# EAGLE design GaggiaBoard_V2 (EAGLE 9.6.2)

## Sheet 1 of 2
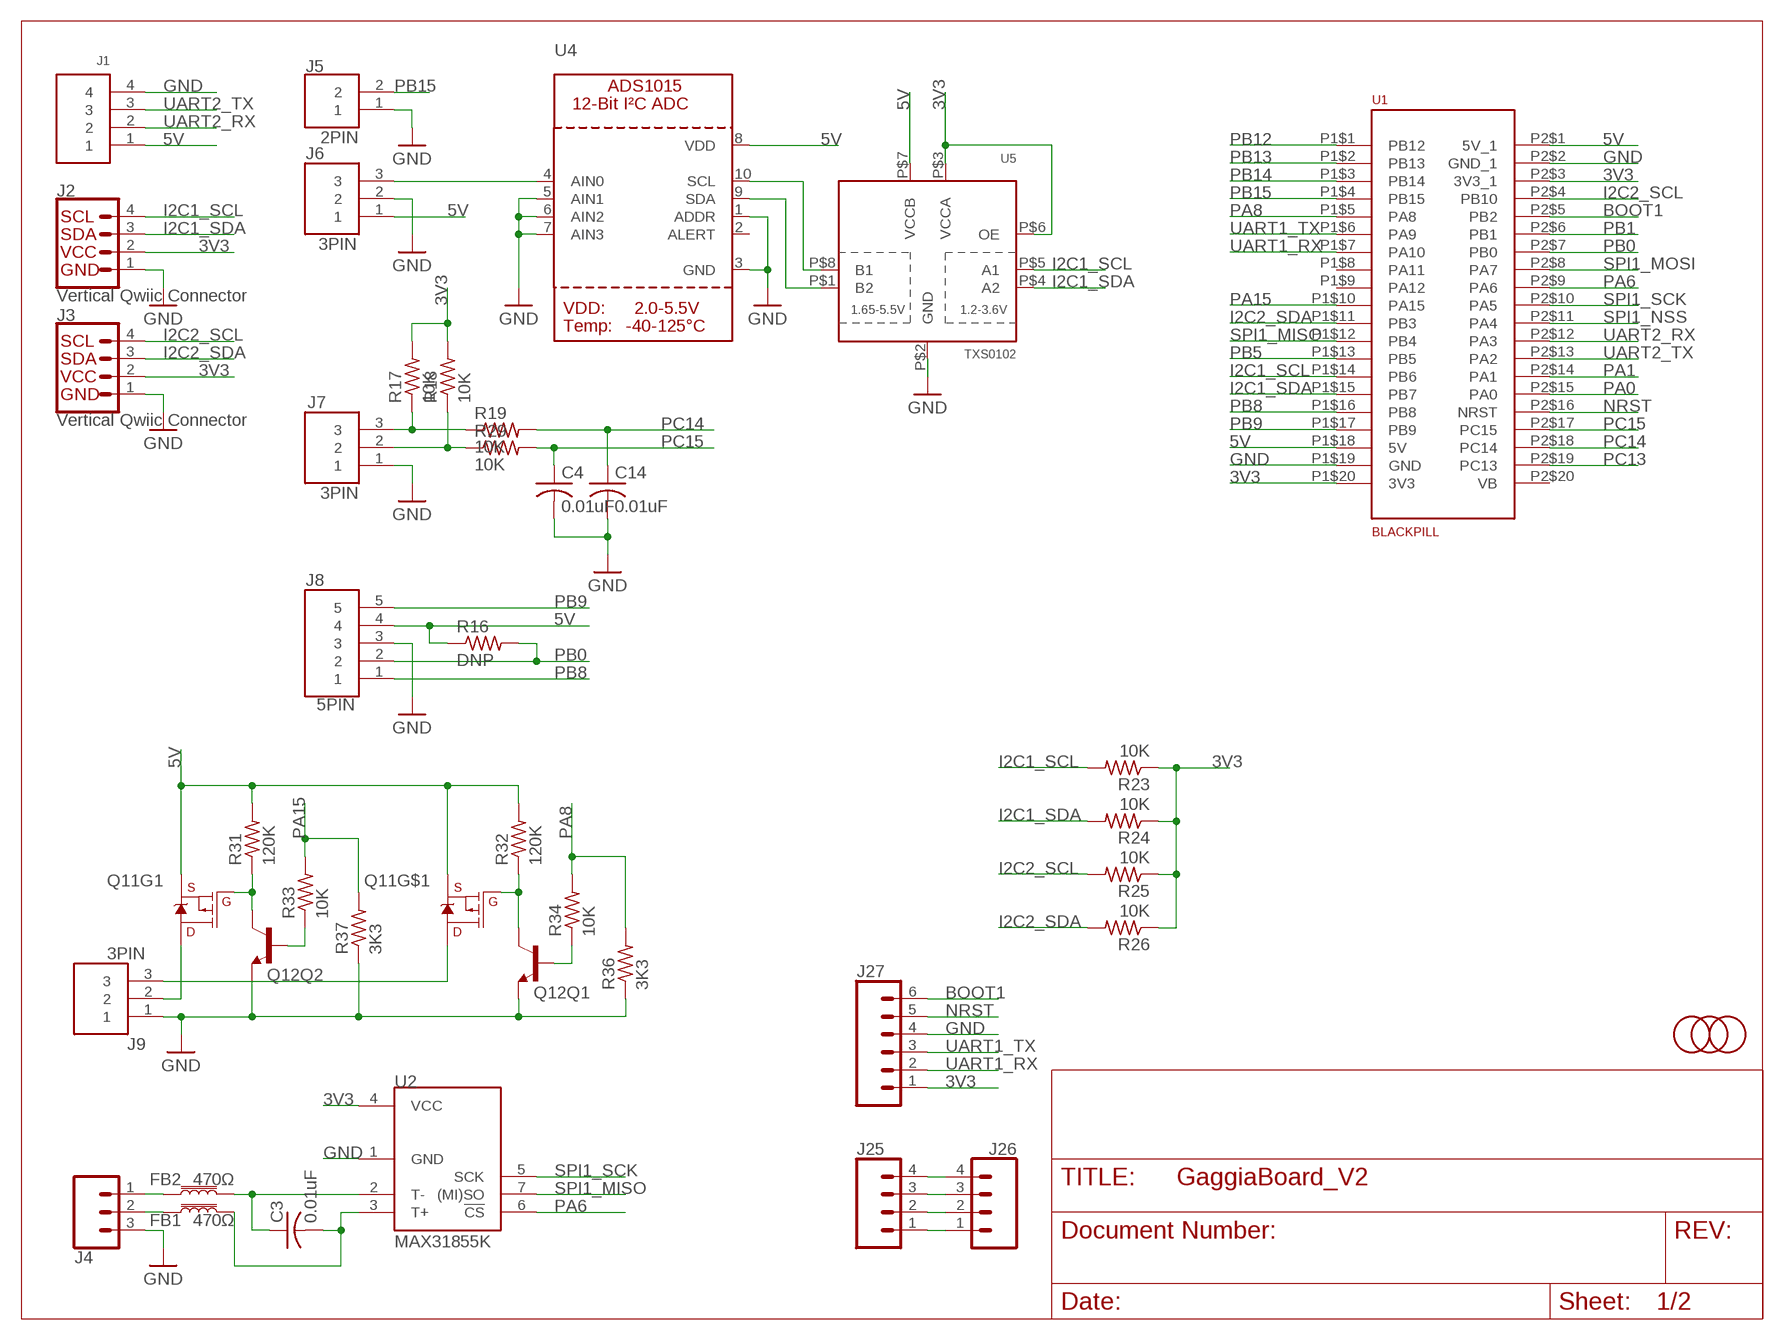
[diagram p0: schematic, sheet 1]

### Parts
C3  0.01uF  C-USC0603  [C0603]
C4  0.01uF  C-USC0603  [C0603]
C14  0.01uF  C-USC0603  [C0603]
FB1  470Ω  FERRITE_BEAD-0603-470Ω-100MHZ-1A-200MILIΩ  [0603]
FB2  470Ω  FERRITE_BEAD-0603-470Ω-100MHZ-1A-200MILIΩ  [0603]
J1  4PIN  [B4B-XH-K-S]
J2  Vertical Qwiic Connector  QWIIC_CONNECTOR  [JST04_1MM_VERT]
J3  Vertical Qwiic Connector  QWIIC_CONNECTOR  [JST04_1MM_VERT]
J4  CONN_03SCREW  [SCREWTERMINAL-3.5MM-3]
J5  2PIN  [B2B-PH-K-S]
J6  3PIN  [B3B-PH-K-S]
J7  3PIN  [B3B-PH-K-S]
J8  5PIN  [B5B-PH-K-S]
J9  3PIN  [B3B-PH-K-S]
J25  CONN_041X04_NO_SILK  [1X04_NO_SILK]
J26  CONN_041X04_NO_SILK  [1X04_NO_SILK]
J27  CONN_06NO_SILK_FEMALE_PTH  [1X06_NO_SILK]
MARK1  FIDUCIAL  [FIDUCIAL_1MM]
MARK2  FIDUCIAL  [FIDUCIAL_1MM]
MARK5  FIDUCIAL  [FIDUCIAL_1MM]
Q11  MOSFET_PCH_DUAL-DMP2240UDM  [SOT26]
Q12  TRANS_NPN_DUAL-MBT3904DW1T1  [SC70-6]
R16  DNP  R-US_R0603  [R0603]
R17  10K  R-US_R0603  [R0603]
R18  10K  R-US_R0603  [R0603]
R19  10K  R-US_R0603  [R0603]
R23  10K  R-US_R0603  [R0603]
R24  10K  R-US_R0603  [R0603]
R25  10K  R-US_R0603  [R0603]
R26  10K  R-US_R0603  [R0603]
R29  10K  R-US_R0603  [R0603]
R31  120K  R-US_R0603  [R0603]
R32  120K  R-US_R0603  [R0603]
R33  10K  R-US_R0603  [R0603]
R34  10K  R-US_R0603  [R0603]
R36  3K3  R-US_R0603  [R0603]
R37  3K3  R-US_R0603  [R0603]
U1  BLACKPILL  [BLACKPILL]
U2  MAX31855K  [SO08]
U4  ADC_ADS1015  [MSOP10]
U5  TXS0102  [VFSOP-8]

### Nets
3V3: J2.2 J3.2 J25.1 J26.1 J27.1 R17.2 R18.2 R23.1 R24.1 R25.1 R26.1 U1.P1$20(3V3) U1.P2$3(3V3_1) U2.4(VCC) U5.P$3(VCCA) U5.P$6(OE) ; also sheet 2
5V: J1.1 J6.1 J8.4 Q11.S1(S) Q11.S2(S) R16.1 R31.2 R32.2 U1.P1$18(5V) U1.P2$1(5V_1) U4.8(VDD) U5.P$7(VCCB) ; also sheet 2
BOOT1: J27.6 U1.P2$5(PB2)
GND: C4.2 C14.2 J1.4 J2.1 J3.1 J4.3 J5.1 J6.2 J7.1 J8.3 J9.1 J25.4 J26.4 J27.4 Q12.1(Q2:E) Q12.4(Q1:E) R36.1 R37.1 U1.P1$19(GND) U1.P2$2(GND_1) U2.1(GND) U4.1(ADDR) U4.3(GND) U4.5(AIN1) U4.6(AIN2) U4.7(AIN3) U5.P$2(GND) ; also sheet 2
I2C1_SCL: J2.4 R23.2 U1.P1$14(PB6) U5.P$5(A1)
I2C1_SDA: J2.3 R24.2 U1.P1$15(PB7) U5.P$4(A2)
I2C2_SCL: J3.4 R25.2 U1.P2$4(PB10)
I2C2_SDA: J3.3 R26.2 U1.P1$11(PB3)
N$3: FB2.1 J4.1
N$4: FB1.1 J4.2
N$5: C3.1 FB2.2 U2.2(T-)
N$6: J7.3 R17.1 R19.1
N$22: U4.10(SCL) U5.P$8(B1)
N$23: J7.2 R18.1 R29.1
N$26: C3.2 FB1.2 U2.3(T+)
N$38: U4.9(SDA) U5.P$1(B2)
N$41: J9.3 Q11.D2(D)
N$42: J9.2 Q11.D1(D)
N$46: Q12.2(Q2:B) R33.1
N$47: Q11.G2(G) Q12.3(Q1:C) R32.1
N$48: Q11.G1(G) Q12.6(Q2:C) R31.1
N$49: Q12.5(Q1:B) R34.1
NRST: J27.5 U1.P2$16(NRST)
PA0: U1.P2$15(PA0) ; also sheet 2
PA1: U1.P2$14(PA1) ; also sheet 2
PA6: U1.P2$9(PA6) U2.6(!CS)
PA8: R34.2 R36.2 U1.P1$5(PA8)
PA15: R33.2 R37.2 U1.P1$10(PA15)
PB0: J8.2 R16.2 U1.P2$7(PB0)
PB1: U1.P2$6(PB1)
PB5: U1.P1$13(PB5)
PB8: J8.1 U1.P1$16(PB8)
PB9: J8.5 U1.P1$17(PB9)
PB12: U1.P1$1(PB12) ; also sheet 2
PB13: U1.P1$2(PB13) ; also sheet 2
PB14: U1.P1$3(PB14) ; also sheet 2
PB15: J5.2 U1.P1$4(PB15)
PC13: U1.P2$19(PC13) ; also sheet 2
PC14: C14.1 R19.2 U1.P2$18(PC14)
PC15: C4.1 R29.2 U1.P2$17(PC15)
PRESSURE: J6.3 U4.4(AIN0)
SPI1_MISO: U1.P1$12(PB4) U2.7((MI)SO)
SPI1_MOSI: U1.P2$8(PA7)
SPI1_NSS: U1.P2$11(PA4)
SPI1_SCK: U1.P2$10(PA5) U2.5(SCK)
SWCLK: J25.3 J26.3
SWDIO: J25.2 J26.2
UART1_RX: J27.2 U1.P1$7(PA10)
UART1_TX: J27.3 U1.P1$6(PA9)
UART2_RX: J1.2 U1.P2$12(PA3)
UART2_TX: J1.3 U1.P2$13(PA2)
Unconnected: U1.P1$8(PA11) U1.P1$9(PA12) U1.P2$20(VB) U4.2(ALERT)

## Sheet 2 of 2
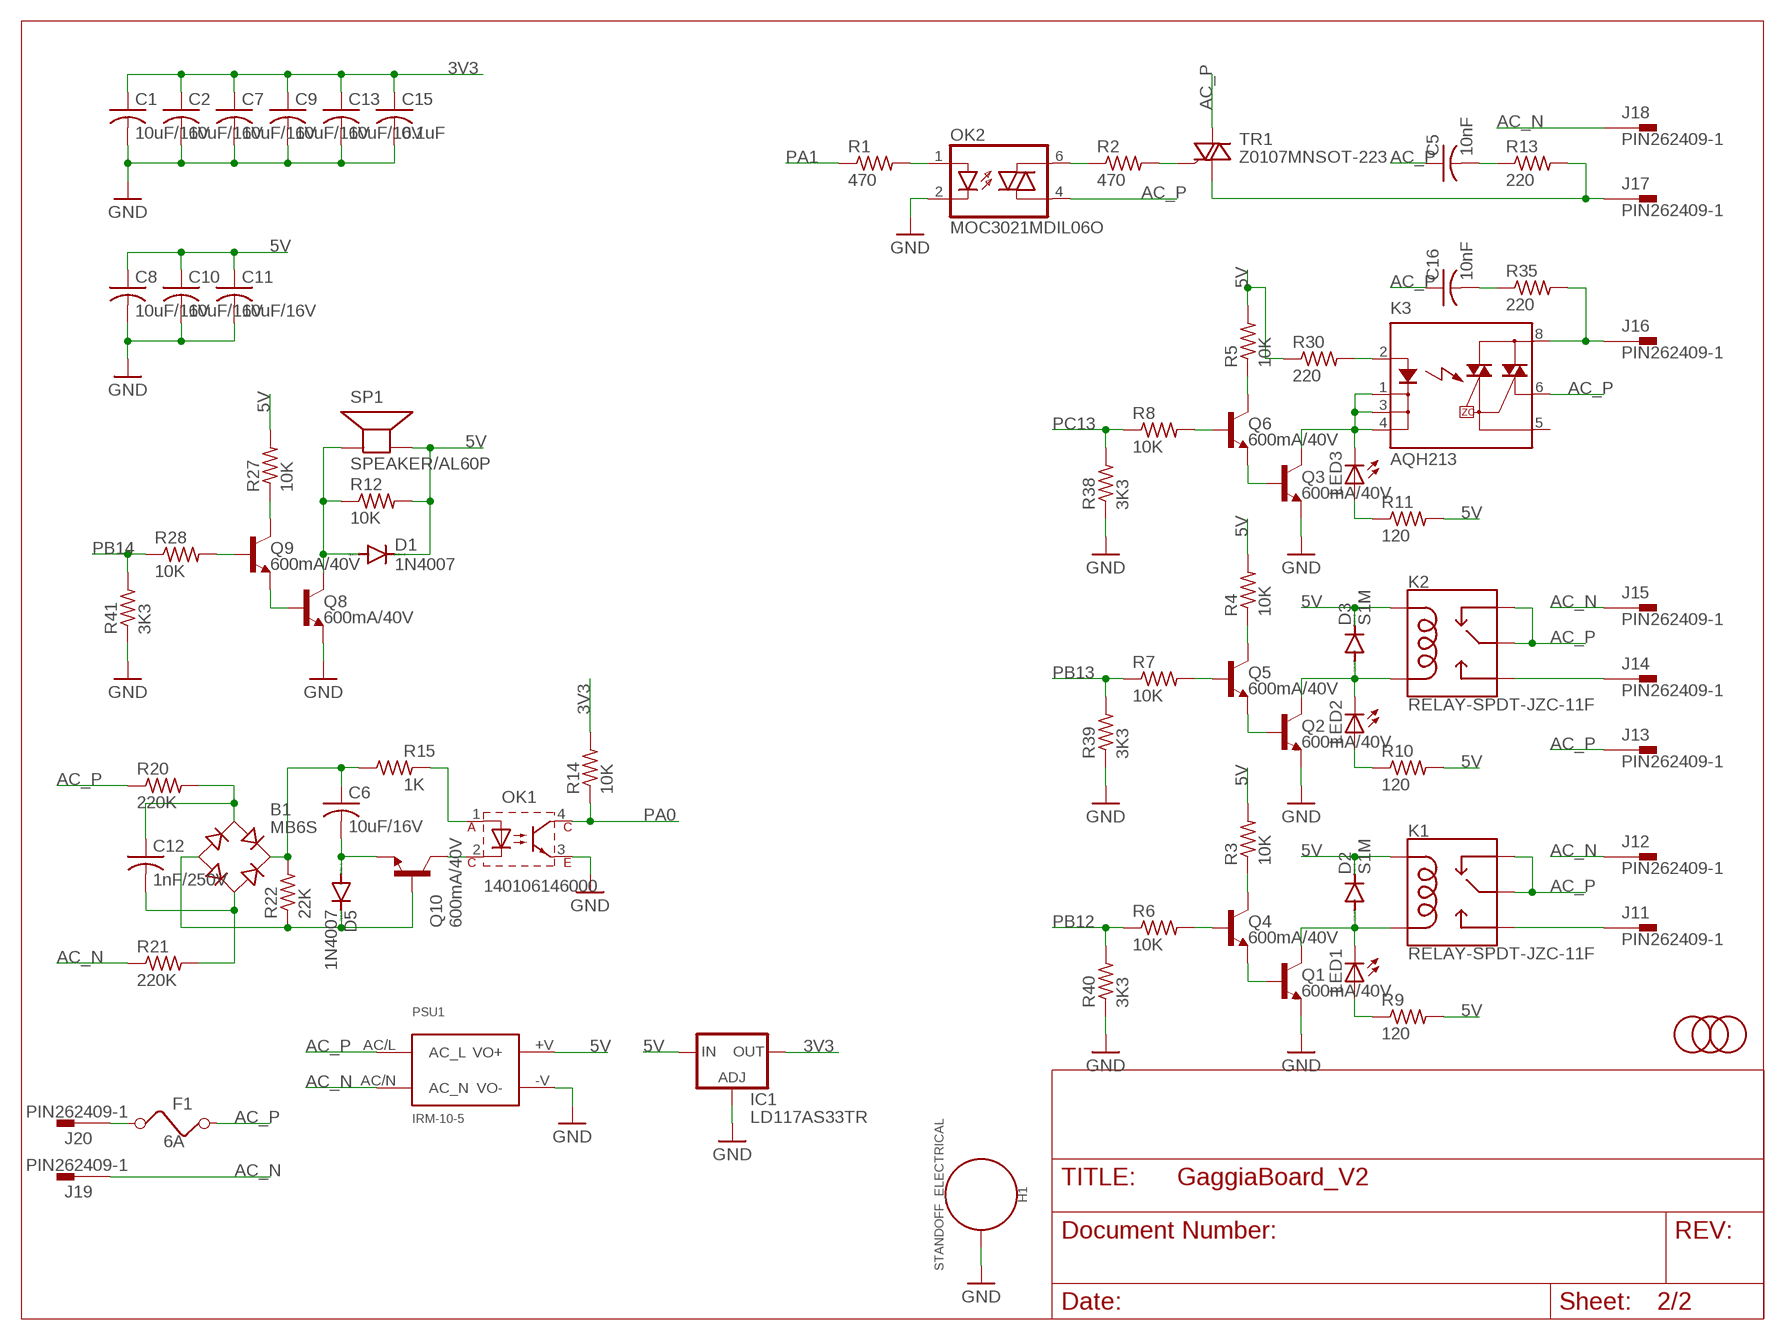
[diagram p1: schematic, sheet 2]

### Parts
B1  MB6S  [SOIC-4]
C1  10uF/16V  C-USC0603  [C0603]
C2  10uF/16V  C-USC0603  [C0603]
C5  10nF  C-USC1206  [C1206]
C6  10uF/16V  C-USC0603  [C0603]
C7  10uF/16V  C-USC0603  [C0603]
C8  10uF/16V  C-USC0603  [C0603]
C9  10uF/16V  C-USC0603  [C0603]
C10  10uF/16V  C-USC0603  [C0603]
C11  10uF/16V  C-USC0603  [C0603]
C12  1nF/250V  C-USC0603  [C0603]
C13  10uF/16V  C-USC0603  [C0603]
C15  0.1uF  C-USC0603  [C0603]
C16  10nF  C-USC1206  [C1206]
D1  1N4007  DIODE-DO214AC  [DO214AC]
D2  S1M  [SMA]
D3  S1M  [SMA]
D5  1N4007  DIODE-DO214AC  [DO214AC]
F1  6A  FUSE  [FUSE]
H1  STANDOFF_ELECTRICAL  [STANDOFF-ELECTRICAL]
IC1  LD117AS33TR  [SOT223]
J11  PIN262409-1  [62409-1]
J12  PIN262409-1  [62409-1]
J13  PIN262409-1  [62409-1]
J14  PIN262409-1  [62409-1]
J15  PIN262409-1  [62409-1]
J16  PIN262409-1  [62409-1]
J17  PIN262409-1  [62409-1]
J18  PIN262409-1  [62409-1]
J19  PIN262409-1  [62409-1]
J20  PIN262409-1  [62409-1]
K1  RELAY-SPDT-JZC-11F  [RELAY-JZC]
K2  RELAY-SPDT-JZC-11F  [RELAY-JZC]
K3  AQH213  [DIL07]
LED1  LEDCHIPLED_1206  [CHIPLED_1206]
LED2  LEDCHIPLED_1206  [CHIPLED_1206]
LED3  LEDCHIPLED_1206  [CHIPLED_1206]
MARK3  FIDUCIAL  [FIDUCIAL_1MM]
MARK4  FIDUCIAL  [FIDUCIAL_1MM]
MARK6  FIDUCIAL  [FIDUCIAL_1MM]
OK1  140106146000  WL-OCPT_SERIES_101X_140106146000  [WL-OCPT_LSOP4]
OK2  MOC3021MDIL06O  [DIL06O]
PSU1  IRM-10-5  [IRM-10]
Q1  600mA/40V  TRANS_NPN-MMBT2222AL  [SOT23-3]
Q2  600mA/40V  TRANS_NPN-MMBT2222AL  [SOT23-3]
Q3  600mA/40V  TRANS_NPN-MMBT2222AL  [SOT23-3]
Q4  600mA/40V  TRANS_NPN-MMBT2222AL  [SOT23-3]
Q5  600mA/40V  TRANS_NPN-MMBT2222AL  [SOT23-3]
Q6  600mA/40V  TRANS_NPN-MMBT2222AL  [SOT23-3]
Q8  600mA/40V  TRANS_NPN-MMBT2222AL  [SOT23-3]
Q9  600mA/40V  TRANS_NPN-MMBT2222AL  [SOT23-3]
Q10  600mA/40V  TRANS_NPN-MMBT2222AL  [SOT23-3]
R1  470  R-US_R0603  [R0603]
R2  470  R-US_R0603  [R0603]
R3  10K  R-US_R0603  [R0603]
R4  10K  R-US_R0603  [R0603]
R5  10K  R-US_R0603  [R0603]
R6  10K  R-US_R0603  [R0603]
R7  10K  R-US_R0603  [R0603]
R8  10K  R-US_R0603  [R0603]
R9  120  R-US_R0603  [R0603]
R10  120  R-US_R0603  [R0603]
R11  120  R-US_R0603  [R0603]
R12  10K  R-US_R0603  [R0603]
R13  220  R-US_R2512  [R2512]
R14  10K  R-US_R0603  [R0603]
R15  1K  R-US_R0603  [R0603]
R20  220K  R-US_R1206  [R1206]
R21  220K  R-US_R1206  [R1206]
R22  22K  R-US_R0603  [R0603]
R27  10K  R-US_R0603  [R0603]
R28  10K  R-US_R0603  [R0603]
R30  220  R-US_R0603  [R0603]
R35  220  R-US_R2512  [R2512]
R38  3K3  R-US_R0603  [R0603]
R39  3K3  R-US_R0603  [R0603]
R40  3K3  R-US_R0603  [R0603]
R41  3K3  R-US_R0603  [R0603]
SP1  SPEAKER/AL60P  [AL60P]
TR1  Z0107MNSOT-223  [SOT223]

### Nets
3V3: C1.1 C2.1 C7.1 C9.1 C13.1 C15.1 IC1.4(OUT) R14.2 ; also sheet 1
3WAY: J16.A1 J16.A2 K3.8(DS1) R35.2
5V: C8.1 C10.1 C11.1 D1.C D2.C D3.C IC1.3(IN) K1.5(COIL1) K2.5(COIL1) PSU1.+V(VO+) R3.2 R4.2 R5.2 R9.2 R10.2 R11.2 R12.2 R27.2 R30.1 SP1.2(-) ; also sheet 1
AC_N: J12.A1 J12.A2 J15.A1 J15.A2 J18.A1 J18.A2 J19.A1 J19.A2 PSU1.AC/N(AC_N) R21.1
AC_P: C5.1 C16.1 F1.2 J13.A1 J13.A2 K1.2(NC) K1.4(MAIN) K2.2(NC) K2.4(MAIN) K3.6(DS3) OK2.4(A1) PSU1.AC/L(AC_L) R20.1 TR1.2(A2) TR1.4(A2)
GND: C1.2 C2.2 C7.2 C8.2 C9.2 C10.2 C11.2 C13.2 C15.2 H1.P1 IC1.1(ADJ) OK1.3 OK2.2(C) PSU1.-V(VO-) Q1.2(E) Q2.2(E) Q3.2(E) Q8.2(E) R38.1 R39.1 R40.1 R41.1 ; also sheet 1
HEATER_1: J14.A1 J14.A2 K2.3(NO)
HEATER_2: J11.A1 J11.A2 K1.3(NO)
N$1: F1.1 J20.A1 J20.A2
N$2: B1.- D5.C Q10.1(B) R22.1
N$7: OK1.2 Q10.3(C)
N$8: OK2.6(A2) R2.1
N$9: R2.2 TR1.3(G)
N$10: D2.A K1.1(COIL2) LED1.C Q1.3(C)
N$11: D3.A K2.1(COIL2) LED2.C Q2.3(C)
N$12: K3.1(K) K3.3(K1) K3.4(K2) LED3.C Q3.3(C)
N$13: Q1.1(B) Q4.2(E)
N$14: Q2.1(B) Q5.2(E)
N$15: Q3.1(B) Q6.2(E)
N$16: Q6.1(B) R8.2
N$17: Q6.3(C) R5.1
N$18: Q5.3(C) R4.1
N$19: Q5.1(B) R7.2
N$20: Q4.3(C) R3.1
N$21: Q4.1(B) R6.2
N$24: LED1.A R9.1
N$25: K3.2(A) R30.2
N$27: C5.2 R13.1
N$28: LED2.A R10.1
N$29: LED3.A R11.1
N$30: D1.A Q8.3(C) R12.1 SP1.1(+)
N$31: C16.2 R35.1
N$33: Q8.1(B) Q9.2(E)
N$34: Q9.1(B) R28.2
N$35: Q9.3(C) R27.1
N$36: B1.~1(AC1) C12.2 R21.2
N$37: B1.~2(AC2) C12.1 R20.2
N$39: OK2.1(A) R1.2
N$43: C6.2 D5.A Q10.2(E)
N$44: OK1.1 R15.2
N$45: B1.+ C6.1 R15.1 R22.2
PA0: OK1.4 R14.1 ; also sheet 1
PA1: R1.1 ; also sheet 1
PB12: R6.1 R40.2 ; also sheet 1
PB13: R7.1 R39.2 ; also sheet 1
PB14: R28.1 R41.2 ; also sheet 1
PC13: R8.1 R38.2 ; also sheet 1
PUMP_P: J17.A1 J17.A2 R13.2 TR1.1(A1)
Unconnected: K3.5(DS2)

## Library data of the parts
B1 = rectifier:MB*S: Bridge Rectifier Source: http://www.fairchildsemi.com/ds/MB/MB6S.pdf; LCSC: C2487
C1 C2 C6-C11 C13 = rcl:C-US: CAPACITOR, American symbol; LCSC: C86275; SPICEPREFIX: C
C3 C4 C14 = rcl:C-US: CAPACITOR, American symbol; LCSC: C100042; SPICEPREFIX: C
C5 C16 = rcl:C-US: CAPACITOR, American symbol; LCSC: C107192; SPICEPREFIX: C
C12 = rcl:C-US: CAPACITOR, American symbol; LCSC: C277510; SPICEPREFIX: C
C15 = rcl:C-US: CAPACITOR, American symbol; LCSC: C1591; SPICEPREFIX: C
D1 D5 = diode:DIODE-: DIODE; LCSC: C727081
D2 D3 = diode:S1M; LCSC: C155378
F1 = special:FUSE: FUSE 5 x 20 mm; LCSC: C206887
FB1 FB2 = SparkFun-Coils:FERRITE_BEAD: Ferrite Bead (blocks, cores, rings, chokes, etc.) Inductor with layers of ferrite used to suppress high frequencies. Often used to isolate high frequency noise. SparkFun Products: IOIO-OTG - V2.2 <https://www.sparkfun.com/products/13613> SparkFun SAMD21 Mini Breakout <https://www.sparkfun.com/products/13664> SparkFun 6 Degrees of Freedom Breakout - LSM6DS3 <https://www.sparkfun.com/products/13339> SparkFun SAMD21 Dev Breakout <https://www.sparkfun.com/products/13672>; LCSC: C883591; PROD_ID: NDUC-12579
H1 = SparkFun-Hardware:STANDOFF_ELECTRICAL: Stand Off Drill holes with an electrical connection. For example, use these to ground your board to a chassis. Example SparkFun Products Screw - Phillips Head (1/4", 4-40, 10 pack) <https://www.sparkfun.com/products/10453> (PRT-10453) Screw - Phillips Head (1/2", 4-40, 10 pack) <https://www.sparkfun.com/products/10452> (PRT-10452) Screw - Phillips Head (3/4", 4-40, 10 pack) <https://www.sparkfun.com/products/10451> (PRT-10451) Screw - Phillips Head (1", 4-40, 10 pack) <https://www.sparkfun.com/products/10450> (PRT-10450)
IC1 = v-reg:LD117A?*: Low drop fixed and adjustable positive voltage regulators 1 A Source: http://www.st.com/stonline/products/literature/ds/7194/ld1117axx.pdf; LCSC: C26537
J1 = jst_exh:4PIN; LCSC: C144395
J2 J3 = SparkFun-Connectors:QWIIC_CONNECTOR: SparkFun I2C Standard Qwiic Connector An SMD 1mm pitch JST connector makes it easy and quick (get it? Qwiic?) to connect I2C devices to each other. The Qwiic system <http://www.sparkfun.com/qwiic> enables fast and solderless connection between popular platforms and various sensors and actuators. We carry 200mm <https://www.sparkfun.com/products/14204>, 100mm <https://www.sparkfun.com/products/14205>, 50mm <https://www.sparkfun.com/products/14206>, and breadboard friendly <https://www.sparkfun.com/products/14207> Qwiic cables. We also offer 10 pcs strips <https://www.sparkfun.com/products/14323> the SMD connectors.; LCSC: C160390; PROD_ID: CONN-14483
J4 = SparkFun-Connectors:CONN_03: Multi connection point. Often used as Generic Header-pin footprint for 0.1 inch spaced/style header connections On any of the 0.1 inch spaced packages, you can populate with these: Break Away Headers - Straight <https://www.sparkfun.com/products/116> (PRT-00116) Break Away Male Headers - Right Angle <https://www.sparkfun.com/products/553> (PRT-00553) Female Headers <https://www.sparkfun.com/products/115> (PRT-00115) Break Away Headers - Machine Pin <https://www.sparkfun.com/products/117> (PRT-00117) Break Away Female Headers - Swiss Machine Pin <https://www.sparkfun.com/products/743> (PRT-00743) Stackable Header - 3 Pin (Female, 0.1") <https://www.sparkfun.com/products/13875> (PRT-13875) For SCREWTERMINALS and SPRING TERMINALS visit here: Screw Terimnals on SparkFun.com <https://www.sparkfun.com/search/results?term=Screw+Terminals> (5mm/3.5mm/2.54mm spacing) This device is also useful as a general connection point to wire up your design to another part of your project. Our various solder wires solder well into these plated through hole pads. Hook-Up Wire - Assortment (Stranded, 22 AWG) <https://www.sparkfun.com/products/11375> (PRT-11375) Hook-Up Wire - Assortment (Solid Core, 22 AWG) <https://www.sparkfun.com/products/11367> (PRT-11367) View the entire wire category on our website here <https://www.sparkfun.com/categories/141> Special notes: Molex polarized connector foot print use with SKU : PRT-08232 with associated crimp pins and housings.; LCSC: C474893; PROD_ID: CONN-08288; SF_ID: PRT-08235
J5 = jst_eph:2PIN; LCSC: C131337
J6 J7 J9 = jst_eph:3PIN; LCSC: C131339
J8 = jst_eph:5PIN; LCSC: C157993
J11-J20 = con-faston:PIN2: Flachstecker Typ Tyco/Electronics/AMP TAB, FASTON Printed Circuit Board Tabs Source: http://www.buerklin.com, http://catalog.tycoelectronics.com; LCSC: C86495; OC_FARNELL: unknown; OC_NEWARK: unknown
J25 J26 = SparkFun-Connectors:CONN_04: Multi connection point. Often used as Generic Header-pin footprint for 0.1 inch spaced/style header connections On any of the 0.1 inch spaced packages, you can populate with these: Break Away Headers - Straight <https://www.sparkfun.com/products/116> (PRT-00116) Break Away Male Headers - Right Angle <https://www.sparkfun.com/products/553> (PRT-00553) Female Headers <https://www.sparkfun.com/products/115> (PRT-00115) Break Away Headers - Machine Pin <https://www.sparkfun.com/products/117> (PRT-00117) Break Away Female Headers - Swiss Machine Pin <https://www.sparkfun.com/products/743> (PRT-00743) For SCREWTERMINALS and SPRING TERMINALS visit here: Screw Terimnals on SparkFun.com <https://www.sparkfun.com/search/results?term=Screw+Terminals> (5mm/3.5mm/2.54mm spacing) This device is also useful as a general connection point to wire up your design to another part of your project. Our various solder wires solder well into these plated through hole pads. Hook-Up Wire - Assortment (Stranded, 22 AWG) <https://www.sparkfun.com/products/11375> (PRT-11375) Hook-Up Wire - Assortment (Solid Core, 22 AWG) <https://www.sparkfun.com/products/11367> (PRT-11367) View the entire wire category on our website here <https://www.sparkfun.com/categories/141> Special notes: Molex polarized connector foot print use with SKU : PRT-08231 with associated crimp pins and housings. 1MM SMD Version SKU: PRT-10208; PROD_ID: CONN-09696
J27 = SparkFun-Connectors:CONN_06: Multi connection point. Often used as Generic Header-pin footprint for 0.1 inch spaced/style header connections On any of the 0.1 inch spaced packages, you can populate with these: Break Away Headers - Straight <https://www.sparkfun.com/products/116> (PRT-00116) Break Away Male Headers - Right Angle <https://www.sparkfun.com/products/553> (PRT-00553) Female Headers <https://www.sparkfun.com/products/115> (PRT-00115) Break Away Headers - Machine Pin <https://www.sparkfun.com/products/117> (PRT-00117) Break Away Female Headers - Swiss Machine Pin <https://www.sparkfun.com/products/743> (PRT-00743) Arduino Stackable Header - 6 Pin <https://www.sparkfun.com/products/9280> (PRT-09280) For SCREWTERMINALS and SPRING TERMINALS visit here: Screw Terimnals on SparkFun.com <https://www.sparkfun.com/search/results?term=Screw+Terminals> (5mm/3.5mm/2.54mm spacing) This device is also useful as a general connection point to wire up your design to another part of your project. Our various solder wires solder well into these plated through hole pads. Hook-Up Wire - Assortment (Stranded, 22 AWG) <https://www.sparkfun.com/products/11375> (PRT-11375) Hook-Up Wire - Assortment (Solid Core, 22 AWG) <https://www.sparkfun.com/products/11367> (PRT-11367) View the entire wire category on our website here <https://www.sparkfun.com/categories/141>; PROD_ID: CONN-08437
K1 K2 = SparkFun-Electromechanical:RELAY-SPDT: SPDT Electromechanical Relay Single-pole, double-throw sealed relays. When current is applied to the coil, it throws a simple changeover switch, terminating the connection from the NC contact to ground and closing the NO contact. Use them to switch high voltage/high current devices. SparkFun Products JQX-15F: Relay SPDT Sealed - 20A <https://www.sparkfun.com/products/10924> (COM-10924) JZC-11F: Relay SPDT Sealed <https://www.sparkfun.com/products/100> (COM-00100); LCSC: C74541; PROD_ID: COMP-09533; SF_SKU: COM-00100
K3 = relay:AQH*213: SOLID STATE RELAY NAiS Source: http://www.mew-europe.com/.. en_ds_61613_0000.pdf; LCSC: C719560; OC_FARNELL: unknown; OC_NEWARK: unknown
LED1-LED3 = adafruit:LED: LED OSRAM: - CHIPLED LG R971, LG N971, LY N971, LG Q971, LY Q971, LO R971, LY R971 LH N974, LH R974 LS Q976, LO Q976, LY Q976 LO Q996 - Hyper CHIPLED LW Q18S LB Q993, LB Q99A, LB R99A - SideLED LS A670, LO A670, LY A670, LG A670, LP A670 LB A673, LV A673, LT A673, LW A673 LH A674 LY A675 LS A676, LA A676, LO A676, LY A676, LW A676 LS A679, LY A679, LG A679 - Hyper Micro SIDELED® LS Y876, LA Y876, LO Y876, LY Y876 LT Y87S - SmartLED LW L88C, LW L88S LB L89C, LB L89S, LG L890 LS L89K, LO L89K, LY L89K LS L896, LA L896, LO L896, LY L896 - TOPLED LS T670, LO T670, LY T670, LG T670, LP T670 LSG T670, LSP T670, LSY T670, LOP T670, LYG T670 LG T671, LOG T671, LSG T671 LB T673, LV T673, LT T673, LW T673 LH T674 LS T676, LA T676, LO T676, LY T676, LB T676, LH T676, LSB T676, LW T676 LB T67C, LV T67C, LT T67C, LS T67K, LO T67K, LY T67K, LW E67C LS E67B, LA E67B, LO E67B, LY E67B, LB E67C, LV E67C, LT E67C LW T67C LS T679, LY T679, LG T679 LS T770, LO T770, LY T770, LG T770, LP T770 LB T773, LV T773, LT T773, LW T773 LH T774 LS E675, LA E675, LY E675, LS T675 LS T776, LA T776, LO T776, LY T776, LB T776 LHGB T686 LT T68C, LB T68C - Hyper Mini TOPLED® LB M676 - Mini TOPLED Santana® LG M470 LS M47K, LO M47K, LY M47K Source: http://www.osram.convergy.de/; LCSC: C125086
MARK1-MARK6 = adafruit:FIDUCIAL: For use by pick and place machines to calibrate the vision/machine, 1mm By microbuilder.eu
OK1 = Wurth_Optocoupler_WL-OCPT:WL-OCPT_SERIES_101X: WL-OCPT LSOP-4 Series 101x Characteristics High isolation voltage Good stability of inner isolation Stable CTR in full operation temperature range Different CTR binnings available High Collector-Emitter voltage Fast switching times Applications Power Supply, charger Computers & Microprocessors Office equipment Instrumental applications, machines Ammeter, Smart Meter <https://www.we-online.de/katalog/media/o198230v209%20WL-OCPT_LSOP4_101x_multi-parts.jpg> Details see: www.we-online.com/catalog/WL-OCPT_PACKAGE_LSOP-4 <www.we-online.com/catalog/WL-OCPT_PACKAGE_LSOP-4/?utm_source=eagle_model&utm_medium=description_link&utm_campaign=eisos_eagle> Updated by Ella Wu, 2022-06-21 2022 (C) Wurth Elektronik; CTR-MAX: 300%; CTR-MIN: 100%; DATASHEET-URL: https://www.we-online.com/redexpert/spec/140106146000?ae; IF: 60mA; LCSC: C141610; MOUNT: SMT; PART-NUMBER: 140106146000; TC-CTR: IF = 5mA,VCE = 5 V; VCE: 80V; VISO: 5000(V(RMS))
OK2 = discrete:MOC3021M: RANDOM-PHASE OPTOISOLATORS TRIAC DRIVER OUTPUT; LCSC: C5242
PSU1 = discrete:IRM-10-5: MEAN WELL IRM-10-5 5V 10W Output Switching Power Supply; LCSC: C2857903; SPICEPREFIX: E
Q1-Q6 Q8-Q10 = SparkFun-DiscreteSemi:TRANS_NPN: NPN transistor Current controlled devices typically used to amplify current or used as a switch. BC547 - COM-08928 <http://www.sparkfun.com/products/8928> (TO-92 45V 100mA) (1.Collector 2.Base 3.Emitter) 2N3904 - COM-00521 <http://www.sparkfun.com/products/521> (TO-92 40V 200mA) (1.Emitter 2.Base 3.Collector) P2N2222A - COM-12852 <http://www.sparkfun.com/products/12852> (TO-92 40V 600mA) (1.Collector 2.Base 3.Emitter); LCSC: C82460; PROD_ID: TRANS-08049
Q11 = SparkFun-DiscreteSemi:MOSFET_PCH_DUAL: Dual P-Channel -20VDS MOSFET Link to datasheet <http://www.diodes.com/_files/datasheets/ds31197.pdf> SparkFun Products: SparkFun FreeSoC2 Development Board <https://www.sparkfun.com/products/13229>; LCSC: C397948; PROD_ID: TRANS-12444; VALUE: 2A/20V/150mΩ
Q12 = SparkFun-DiscreteSemi:TRANS_NPN_DUAL: Dual NPN Transistors in Single Package The MBT3904W1 puts two general purpose 3904 NPN transistors in a single package. Datasheet <http://www.onsemi.com/pub_link/Collateral/MBT3904DW1T1-D.PDF> SparkFun Products: SparkFun ESP32 Thing <https://www.sparkfun.com/products/13907>; LCSC: C896759; PROD_ID: TRANS-13337
R1 R2 = rcl:R-US_: RESISTOR, American symbol; LCSC: C114669; SPICEPREFIX: R
R3-R8 R12 R14 R17-R19 R23-R29 R33 R34 = rcl:R-US_: RESISTOR, American symbol; LCSC: C98220; SPICEPREFIX: R
R9-R11 = rcl:R-US_: RESISTOR, American symbol; LCSC: C114640; SPICEPREFIX: R
R13 R35 = rcl:R-US_: RESISTOR, American symbol; LCSC: C877859; SPICEPREFIX: R
R15 = rcl:R-US_: RESISTOR, American symbol; LCSC: C22548; SPICEPREFIX: R
R16 = rcl:R-US_: RESISTOR, American symbol; SPICEPREFIX: R
R20 R21 = rcl:R-US_: RESISTOR, American symbol; LCSC: C130275; SPICEPREFIX: R
R22 = rcl:R-US_: RESISTOR, American symbol; LCSC: C114065; SPICEPREFIX: R
R30 = rcl:R-US_: RESISTOR, American symbol; LCSC: C107696; SPICEPREFIX: R
R31 R32 = rcl:R-US_: RESISTOR, American symbol; LCSC: C114607; SPICEPREFIX: R
R36-R41 = rcl:R-US_: RESISTOR, American symbol; LCSC: C114432; SPICEPREFIX: R
SP1 = adafruit:SPEAKER: SPEAKER Source: Buerklin Added PS12 (for part # PS1240 piezo) http://www.ladyada.net/library/pcb/eaglelibrary.html; LCSC: C96093
TR1 = discrete:Z0107MN: Triacs 1.0 Amp 600 Volt; LCSC: C71218
U1 = discrete:BLACKPILL: STM32 BlackPill
U2 = SparkFun-IC-Conversion:MAX31855K: Cold-Junction-Compensated K-Thermocoupleto-Digital Converter (-270°C to +1800°C) The MAX31855K performs cold-junction compensation and digitizes the signal from a type-K thermocouple. The data is output in a 14-bit resolution, SPI™-compatible, read-only format. This converter resolves temperatures to 0.25°C, allows readings as high as +1800°C and as low as -270°C, and exhibits thermocouple accuracy of ±2°C for temperatures ranging from -200°C to +700°C for K-type thermocouples. Datasheet <https://cdn.sparkfun.com/datasheets/Sensors/Temp/MAX31855K.pdf> SparkFun Products SparkFun Thermocouple Breakout - MAX31855K <https://www.sparkfun.com/products/13266> (SEN-13266); LCSC: C52028; PROD_ID: IC-12578
U4 = microbuilder:ADC_ADS1015: ADS1015 - 12-bit 4-Channel I2C ADC with Internal PGA VDD: 2.0-5.5V Sampling Rate: 3.3ksps Gain Settings: 2/3, 1, 2, 4, 8, 16 I2C Address: ADDR low = 1001000x, ADDR high = 1001001x Internal Comparator The ADS1015 includes an internal comparator that can be set to output a high-level on ALERT when the conversion results exceeeds a pre-defined upper level, and will deassert itself when the level falls below a pre-defined lower threshold level. It can also be set to windowed mode where the ALERT pin will be asserted if the data exceeds the upper threshold or falls below the lower threshold.; LCSC: C193969
U5 = adafruit:TXS0102: 2-Bit Bi-Directional Level Shifter (I2C, etc.) Designed for I2C devices and has internal pullups. Not to be confused with TXB010x series. 1.2V-3.6V (VCCA) to 1.65V-5.5V (VCCB) bi-directional level shifter with auto direction sensing. Max data rate - 24Mbps (Push Pull), 2Mbps (Open Drain) Digikey: 296-21931-1-ND; LCSC: C53434

## Board
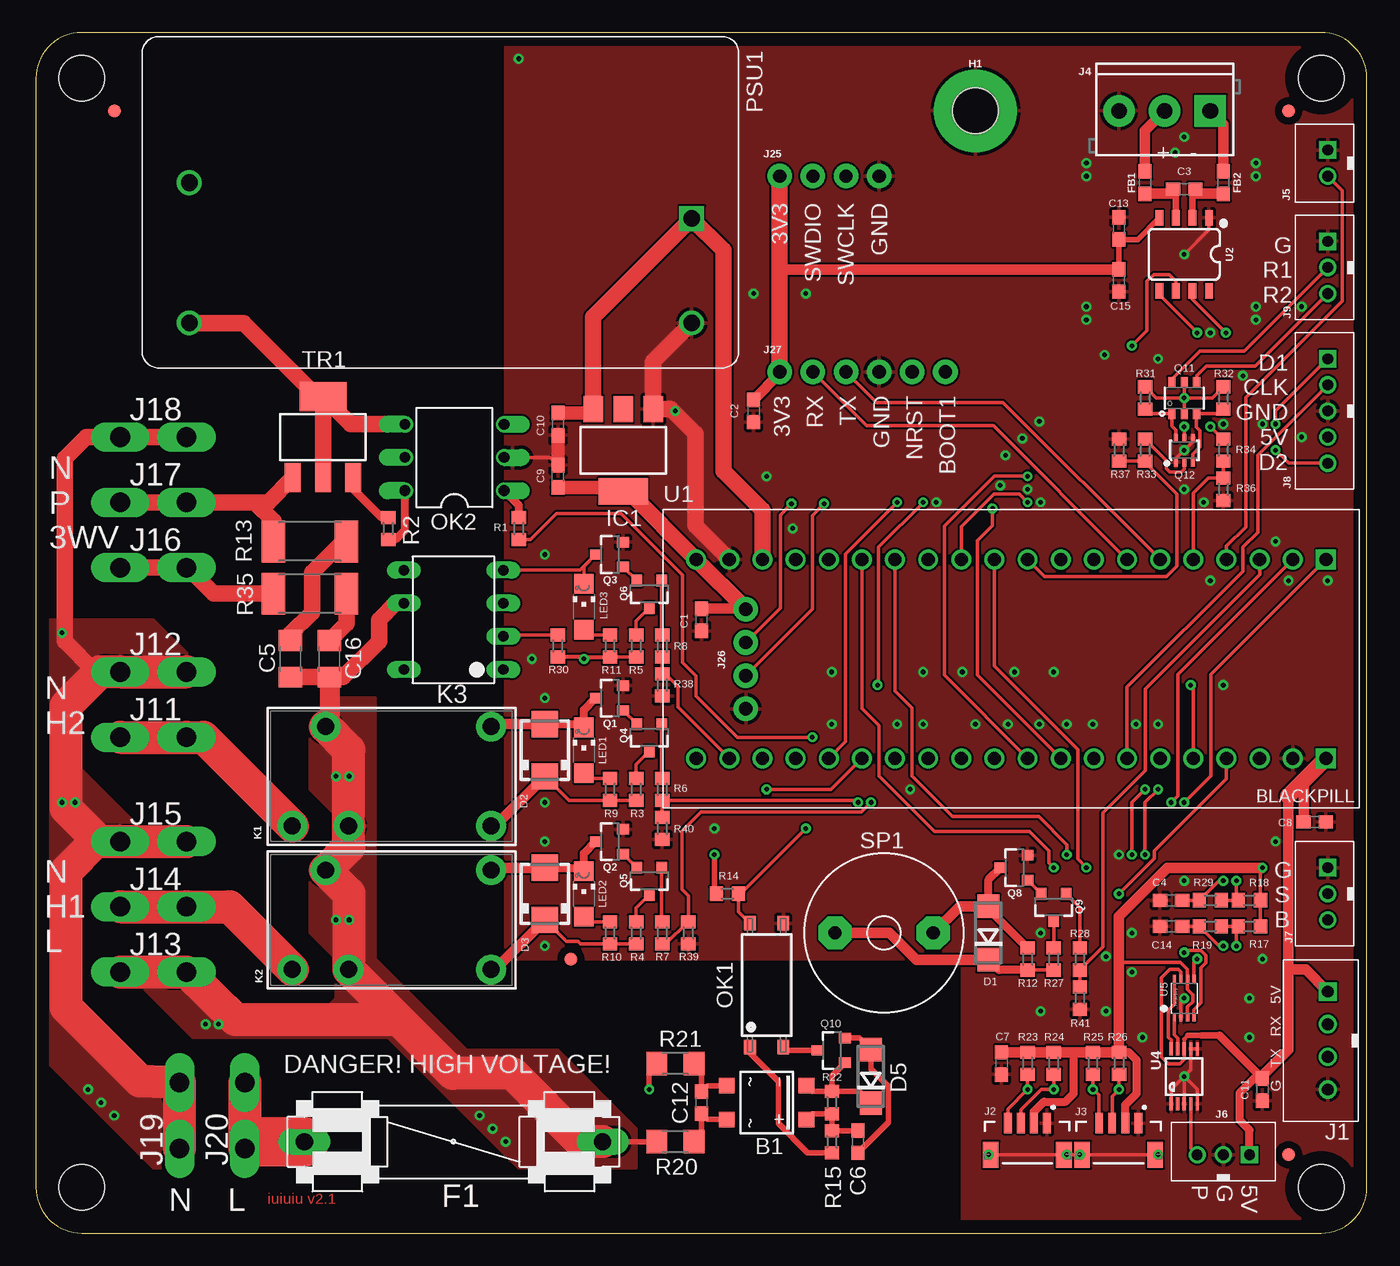
[diagram p2: board, top side]
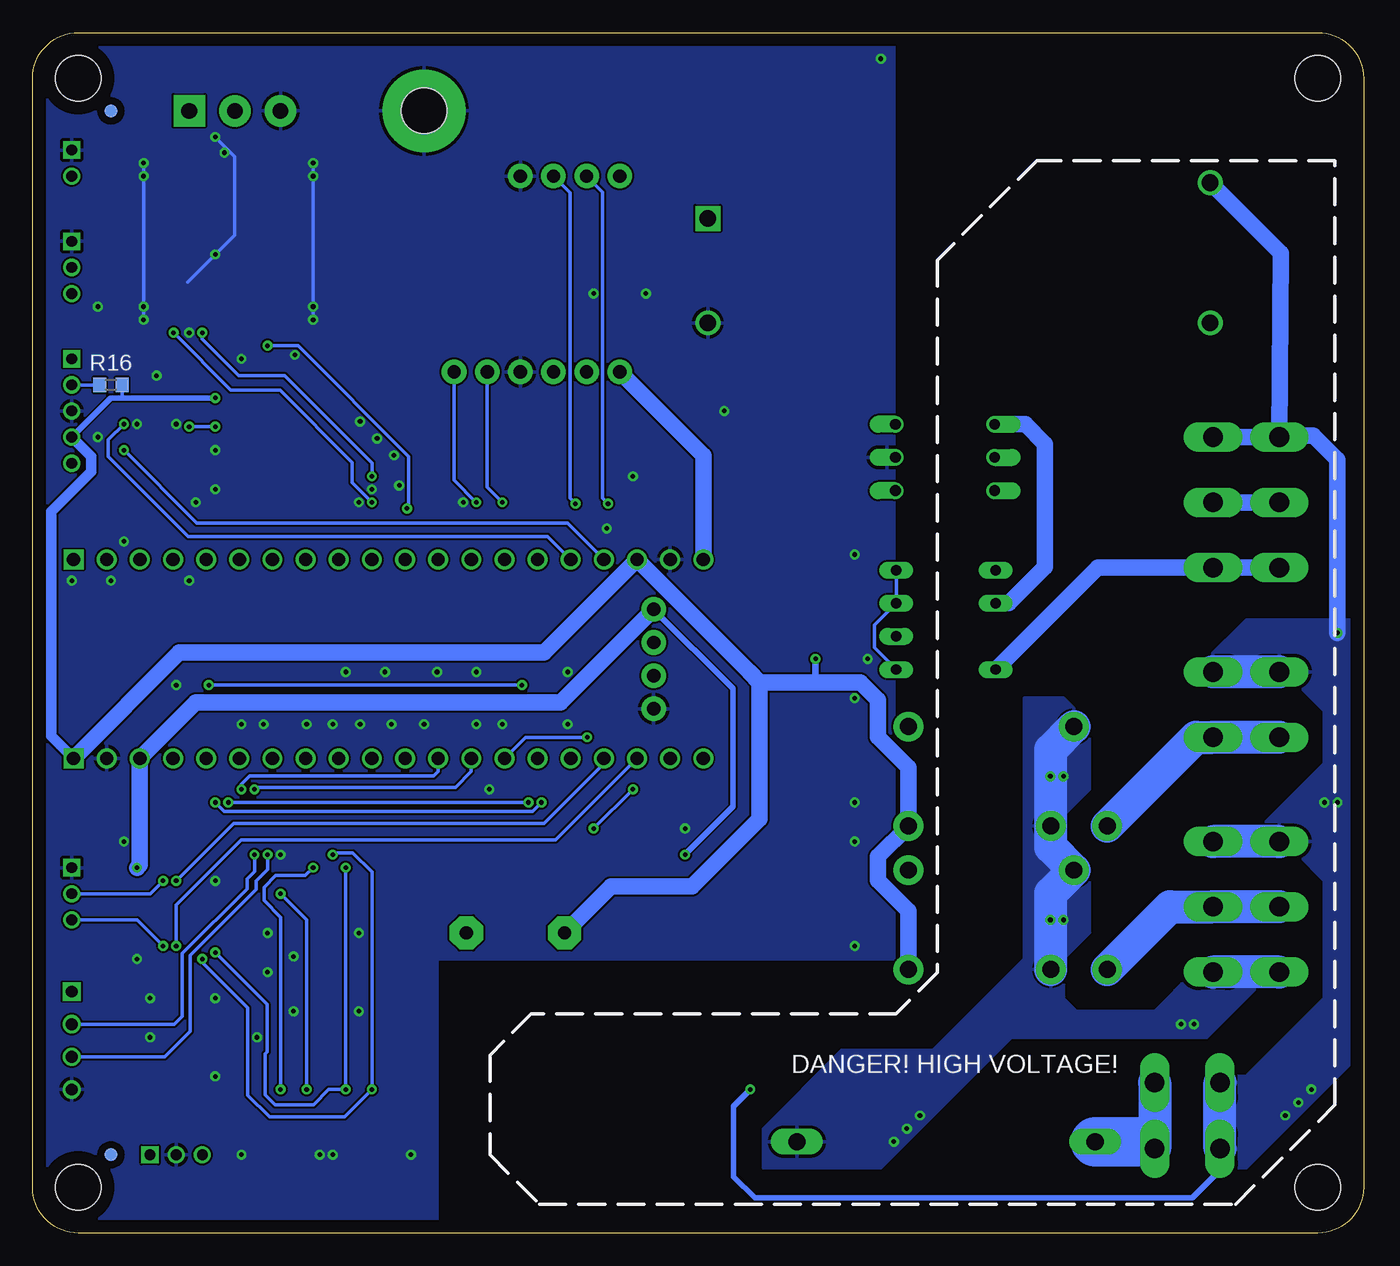
[diagram p3: board, bottom side, seen from below]

Size 102 x 92 mm. Coordinates in mm from the lower left corner, seen from the top.
Outline: 3.5,0 98.5,0 arc90 102,3.5 102,88.5 arc90 98.5,92 3.5,92 arc90 0,88.5 0,3.5 arc90 3.5,0
Copper layers (1*16): Top 0.035mm / dielectric 1.5mm / Bottom 0.035mm
Design rules "default *": minimum track width 6mil, minimum drill 0.35mm, track to track 6mil, track to pad 6mil, pad to pad 6mil, via to via 6mil, smd to smd 6mil, copper to edge 40mil, drill to drill 6mil, minimum pad ring 10mil, minimum via ring 8mil, stop-mask expansion 4mil, vias tented up to drill 100mil, thermal gap 10mil
Holes 3.5 mm at 3.5,3.5 98.5,3.5 3.5,88.5 98.5,88.5 72,86

### Footprints (pad centres in the part's own frame; a part is rotated, then mirrored left to right if it is on the bottom)
SOIC-4 = smd 1.2 x 1.2: + 1.3,3.05; - -1.3,3.05; ~1 -1.3,-3.05; ~2 1.3,-3.05
C0603 = smd 1.1 x 1: 1 -0.85,0; 2 0.85,0
C1206 = smd 1.6 x 1.8: 1 -1.4,0; 2 1.4,0
DO214AC = smd 1.8 x 1.7: A 2.05,0; C -2.05,0
SMA = smd 2 x 2: A 2,0; C -2,0
FUSE = drill 1.321 long: 1 -11.43,0; 2 11.43,0
0603 = smd 1.1 x 1: 1 -0.85,0; 2 0.85,0
STANDOFF-ELECTRICAL = drill 3.2 pad 6.35: P1 0,0
SOT223 = smd 1.5 x 2: 1 -2.3,-3.15; 2 0,-3.15; 3 2.3,-3.15 | smd 3.8 x 2: 4 0,3.15
B4B-XH-K-S = drill 0.9 square: 1 3.75,0 | drill 0.9: 2 1.25,0; 3 -1.25,0; 4 -3.75,0
JST04_1MM_VERT = smd 0.6 x 1.55: 1 -1.478,0.775; 2 -0.478,0.775; 3 0.522,0.775; 4 1.522,0.775 | smd 1.2 x 2: NC1 -2.778,3.2; NC2 2.822,3.2
SCREWTERMINAL-3.5MM-3 = drill 1.2 pad 2.413 square: 1 0,0 | drill 1.2 pad 2.413: 2 3.5,0; 3 7,0
B2B-PH-K-S = drill 0.813 square: 1 2,0 | drill 0.813: 2 0,0
B3B-PH-K-S = drill 0.813 square: 1 2,0 | drill 0.813: 2 0,0; 3 -2,0
B5B-PH-K-S = drill 0.813 square: 1 4,0 | drill 0.813: 2 2,0; 3 0,0; 4 -2,0; 5 -4,0
62409-1 = drill 1.5 pad 1.9 long: A1 -2.54,0; A2 2.54,0
1X04_NO_SILK = drill 1.016 pad 1.88: 1 0,0; 2 2.54,0; 3 5.08,0; 4 7.62,0
1X06_NO_SILK = drill 1.016 pad 1.88: 1 0,0; 2 2.54,0; 3 5.08,0; 4 7.62,0; 5 10.16,0; 6 12.7,0
RELAY-JZC = drill 1.3 pad 2.286: 1 3.81,-8.89; 2 -3.81,2.032; 3 -3.81,6.35; 4 3.81,3.81; 5 -3.81,-8.89
DIL07 = drill 0.8 long: 1 -3.81,-3.81; 2 -1.27,-3.81; 3 1.27,-3.81; 4 3.81,-3.81; 5 3.81,3.81; 6 1.27,3.81; 8 -3.81,3.81
CHIPLED_1206 = smd 1.5 x 1.5: A 0,-1.75; C 0,1.75
FIDUCIAL_1MM = smd 1 x 1: 1 0,0
WL-OCPT_LSOP4 = smd 1.1 x 0.9: 1 -4.75,1.27; 2 -4.75,-1.27; 3 4.75,-1.27; 4 4.75,1.27
DIL06O = drill 0.813 offset: 1 -2.54,-3.81; 2 0,-3.81; 3 2.54,-3.81; 4 2.54,3.81; 5 0,3.81; 6 -2.54,3.81
IRM-10 = drill 1.27 square: +V 19.25,-1.25 | drill 1.27: -V 19.25,-9.25; AC/L -19.25,-9.25; AC/N -19.25,1.5
SOT23-3 = smd 0.8 x 0.9: 1 -0.95,-1; 2 0.95,-1; 3 0,1.1
SOT26 = smd 0.55 x 0.8: D1 -0.95,1.2; D2 0.95,1.2; G1 -0.95,-1.2; G2 0.95,-1.2; S1 0,1.2; S2 0,-1.2
SC70-6 = smd 0.3 x 0.66: 1 -0.65,-0.92; 2 0,-0.92; 3 0.65,-0.92; 4 0.65,0.92; 5 0,0.92; 6 -0.65,0.92
R0603 = smd 1 x 1.1: 1 -0.85,0; 2 0.85,0
R2512 = smd 1.8 x 3.2: 1 -2.8,0; 2 2.8,0
R1206 = smd 1.6 x 1.803: 1 -1.422,0; 2 1.422,0
AL60P = drill 1.016 pad 2.54 octagon: 1 -3.759,0; 2 3.759,0
SOT223' = smd 1.219 x 2.235: 1 -2.311,-3.099; 2 0,-3.099; 3 2.311,-3.099 | smd 3.6 x 2.2: 4 0,3.099
BLACKPILL = drill 1.016 square: P1$1 -22.86,-7.62; P2$1 -22.86,7.62 | drill 1.016: P1$2 -20.32,-7.62; P1$3 -17.78,-7.62; P1$4 -15.24,-7.62; P1$5 -12.7,-7.62; P1$6 -10.16,-7.62; P1$7 -7.62,-7.62; P1$8 -5.08,-7.62; P1$9 -2.54,-7.62; P1$10 0,-7.62; P1$11 2.54,-7.62; P1$12 5.08,-7.62; P1$13 7.62,-7.62; P1$14 10.16,-7.62; P1$15 12.7,-7.62; P1$16 15.24,-7.62; P1$17 17.78,-7.62; P1$18 20.32,-7.62; P1$19 22.86,-7.62; P1$20 25.4,-7.62; P2$2 -20.32,7.62; P2$3 -17.78,7.62; P2$4 -15.24,7.62; P2$5 -12.7,7.62; P2$6 -10.16,7.62; P2$7 -7.62,7.62; P2$8 -5.08,7.62; P2$9 -2.54,7.62; P2$10 0,7.62; P2$11 2.54,7.62; P2$12 5.08,7.62; P2$13 7.62,7.62; P2$14 10.16,7.62; P2$15 12.7,7.62; P2$16 15.24,7.62; P2$17 17.78,7.62; P2$18 20.32,7.62; P2$19 22.86,7.62; P2$20 25.4,7.62
SO08 = smd 0.6 x 1.2: 1 -1.905,-2.8; 2 -0.635,-2.8; 3 0.635,-2.8; 4 1.905,-2.8; 5 1.905,2.8; 6 0.635,2.8; 7 -0.635,2.8; 8 -1.905,2.8
MSOP10 = smd 0.25 x 1: 1 -1,-2.113; 2 -0.5,-2.113; 3 0,-2.113; 4 0.5,-2.113; 5 1,-2.113; 6 1,2.113; 7 0.5,2.113; 8 0,2.113; 9 -0.5,2.113; 10 -1,2.113
VFSOP-8 = smd 0.25 x 0.65: P$1 -0.75,-1.45; P$2 -0.25,-1.45; P$3 0.25,-1.45; P$4 0.75,-1.45; P$5 0.75,1.45; P$6 0.25,1.45; P$7 -0.25,1.45; P$8 -0.75,1.45

### Placement (x,y rotation side)
B1  56,10 270 top
C1  51,47 270 top
C2  55,63 270 top
C3  88,80 180 top
C4  87,25.5 180 top
C5  19.5,44 90 top
C6  63,7 270 top
C7  74,13 270 top
C8  98,31.5 0 top
C9  40,58 90 top
C10  40,62 270 top
C11  94,11 270 top
C12  51,10 90 top
C13  83,77 90 top
C14  87,23.5 180 top
C15  83,73 270 top
C16  22.5,44 90 top
D1  73,23 90 top
D2  39,37 90 top
D3  39,26 90 top
D5  64,12 90 top
F1  32,7 0 top
FB1  85,80.5 270 top
FB2  91,80.5 270 top
H1  72,86 0 top
IC1  45,60 180 top
J1  99,14.75 90 top
J2  76,9.2 180 top
J3  83,9.2 180 top
J4  90,86 180 top
J5  99,81 90 top
J6  91,6 0 top
J7  99,26 90 top
J8  99,63 90 top
J9  99,74 90 top
J11  9,38 0 top
J12  9,43 0 top
J13  9,20 0 top
J14  9,25 0 top
J15  9,30 0 top
J16  9,51 0 top
J17  9,56 0 top
J18  9,61 0 top
J19  11,9 90 top
J20  16,9 90 top
J25  57,81 0 top
J26  54.4,47.8 270 top
J27  57,66 0 top
K1  26,35 90 top
K2  26,24 90 top
K3  32,47 90 top
LED1  42,37 0 top
LED2  42,26 0 top
LED3  42,48 0 top
MARK1  6,86 0 top
MARK2  96,86 0 top
MARK3  96,6 0 top
MARK4  41,21 0 top
MARK5  96,86 0 bottom
MARK6  96,6 0 bottom
OK1  56,19 90 top
OK2  32.07,59.44 90 top
PSU1  31,79 0 top
Q1  44,41 90 top
Q2  44,30 90 top
Q3  44,52 90 top
Q4  47,38 180 top
Q5  47,27 180 top
Q6  47,49 180 top
Q8  75,28 90 top
Q9  78,25 180 top
Q10  61,14 90 top
Q11  88,64 0 top
Q12  88,60 0 top
R1  37,54 90 top
R2  27,54 90 top
R3  46,34 270 top
R4  46,23 270 top
R5  46,45 270 top
R6  48,34 90 top
R7  48,23 90 top
R8  48,45 90 top
R9  44,34 270 top
R10  44,23 270 top
R11  44,45 270 top
R12  76,21 270 top
R13  21,53 180 top
R14  53,26 180 top
R15  61,7 270 top
R16  96,65 180 bottom
R17  93,23.5 0 top
R18  93,25.5 0 top
R19  90,23.5 180 top
R20  49,7 0 top
R21  49,13 0 top
R22  61,10 270 top
R23  76,13 270 top
R24  78,13 270 top
R25  81,13 270 top
R26  83,13 270 top
R27  78,21 270 top
R28  80,21 90 top
R29  90,25.5 180 top
R30  40,45 90 top
R31  85,64 90 top
R32  91,64 90 top
R33  85,60 270 top
R34  91,60 270 top
R35  21,49 180 top
R36  91,57 90 top
R37  83,60 270 top
R38  48,42 90 top
R39  50,23 90 top
R40  48,31 90 top
R41  80,18 90 top
SP1  65,23 180 top
TR1  Z0107MNSOT-223  [SOT223']  22,61 0 top
U1  76,44 180 top
U2  88,75 180 top
U4  88,12 0 top
U5  88,18 0 top

### Tracks (layer width: path | path; a pad name or v marks a point on that pad's centre or on a via)
3V3  (via drill 0.35)
  Top 0.254: U5.P$3 88.25,17.32 88.66,17.73 88.66,18.27 88.25,18.68 U5.P$6 88.25,20.21 87.7,20.76 83,20.76 | R17.2 R18.2 93.85,27.85 v94,28
  Top 0.406: C15.1 C13.1 84.44,76.15 U2.4 | R14.2 52,26.15 v52,29
  Top 0.61: J2.2 76.48,9.29 77.25,10.06 78.9,10.06 79.53,10.7 79.53,13.85 | J3.2 83.48,9.82 84.36,10.7 84.36,13.24 83.75,13.85 R26.1
  Top 0.813: v94,28 86.72,28 83,24.28 83,20.76 R26.1 R25.1 79.53,13.85 R24.1 R23.1 C7.1 | J27.1 57,65.85 C2.1 | J26.1 54.35,47.85 C1.1 | C15.1 57.09,73.85 57,73.94
  Top 1.016: C9.1 44.7,57.15 IC1.4
  Top 1.27: IC1.4 45.37,56.85 U1.P1$20 54.4,47.82 J26.1 | J25.1 57,73.94 J27.1
  Bottom 0.406: v52,29 48.32,32.68 48.32,41.72 J26.1
  Bottom 1.27: J27.1 50.6,59.6 U1.P1$20 | J26.1 61.53,40.67 89.49,40.67 U1.P2$3 93.78,28.22 v94,28
3WAY
  Top 1.27: J16.A1 J16.A2 11.65,50.98 13.63,49 R35.2
  Bottom 1.27: J16.A1 J16.A2 20.38,51 K3.8
5V  (via drill 0.35)
  Top 0.254: R11.2 R5.2 | D2.C 40.85,33.15 R9.2 R3.2 | D3.C 40.65,22.35 41.55,22.35 41.75,22.15 R10.2 R4.2 | R12.2 R27.2 | Q11.S2 v88,64 | v88,64 Q11.S1 | 88,14.85 U4.8 88,13.32 87.66,12.98 86.77,12.98 86.24,13.52 86.24,19.56 86.9,20.22 87.53,20.22 87.75,20.01 U5.P$7 | R31.2 85.85,64 v88,64 | R32.2 90.15,64 v88,64
  Top 0.305: 88,14.85 88.3,15.14 | R11.2 42.15,44.15 v42,44 41.85,44.15 R30.1
  Top 0.406: 89.31,15.14 88.3,15.14
  Top 0.508: 90.71,15.14 89.31,15.14
  Top 0.61: R12.2 73.8,20.15 D1.C | J6.1 93,7.9 92.23,8.67 92.23,10.72 93.36,11.85 C11.1 90.71,15.14
  Top 0.813: K1.5 35.19,31.19 D2.C | K2.5 35.19,20.19 D3.C | D1.C 67.47,20.95 65.42,23 SP1.2 | 95.98,20.19 95.98,14.02 94,12.04 C11.1 | 95.98,20.19 95.98,33.5 | U1.P2$1 97.15,34.67 C8.1 | J1.1 97.31,20.19 95.98,20.19
  Top 1.016: C10.1 42.4,62.85 IC1.3
  Top 1.27: IC1.3 42.7,70.2 PSU1.+V 52.69,75.31 52.69,58.41 55.68,55.42 U1.P1$18 | U1.P2$1 95.98,33.5
  Bottom 0.254: R16.1 95.15,64
  Bottom 0.406: J8.4 96,64 95.15,64 v88,64
  Bottom 0.508: v42,44 42,42.63 41.56,42.19
  Bottom 0.813: J8.4 97.53,59.53 97.53,58.36 100.58,55.31 100.58,38.1 U1.P2$1
  Bottom 1.27: K2.5 34.89,24.7 37.2,27.01 37.2,28.86 34.89,31.18 K1.5 34.89,35.7 37.2,38.01 37.2,40.85 38.54,42.19 41.56,42.19 46.3,42.19 | 46.3,42.19 47.12,43.05 U1.P1$18 62.82,44.48 90.76,44.48 U1.P2$1 | SP1.2 57.67,26.57 51.47,26.57 46.3,31.74 46.3,42.19
AC_N  (via drill 0.35)
  Top 0.406: v47,11 47,12.42 R21.1
  Top 1.27: J18.A2 J18.A1 3.85,61 2.19,59.34 2.19,45.37 4.56,43 J12.A1
  Top 2.54: J15.A1 J15.A2 | J12.A2 J12.A1 4.9,43 2.29,40.39 2.29,32.57 4.86,30 J15.A1 | J15.A1 4.6,30 2.29,27.69 2.29,17.33 7.97,11.65 J19.A2 J19.A1
  Bottom 0.406: v47,11 48.27,9.73 48.27,4.33 46.64,2.7 13.11,2.7 11,4.81 J19.A1
  Bottom 1.27: PSU1.AC/N 6.35,75.1 J18.A1 | v2,46 2,59.28 3.84,61.12 6.23,61.12 J18.A1 | J18.A2 J18.A1
  Bottom 2.54: J15.A1 J15.A2 | J19.A1 J19.A2 | J12.A1 J12.A2
  other vias: 3,33 2,33 4,11 5,10 6,9
  pour Bottom: 0,47 9,47 12,44 12,42 5,42 3,40 3,36 6,33 8,31 8,29 5,29 3,27 3,18 8,13 9,12 11,12 12,11 12,6 11,5 9,5 0,14
  pour Top: 0,47 9,47 12,44 12,42 5,42 3,40 3,36 8,31 8,29 5,29 3,27 3,18 9,12 12,12 12,5 9,5 0,14
AC_P  (via drill 0.35)
  Top 0.406: R20.1 F1.2
  Top 1.27: PSU1.AC/L 15.91,69.75 21.56,64.1 TR1.4 | TR1.2 TR1.4 | OK2.4 24.12,61.98 TR1.4 | C5.1 C16.1 23.54,42.6 26.29,45.35 26.29,47 27.55,48.27 K3.6 | 22.5,39.12 K1.4
  Top 1.524: C16.1 22.5,39.12
  Top 2.54: K1.4 23.97,37.03 K1.2 23.97,29.59 K2.4 23.97,26.03 K2.2 27.79,16.36 | 27.79,16.36 31.93,12.22 36.52,12.22 41.75,7 F1.2 | 27.79,16.36 15.29,16.36 J13.A2 J13.A1
  Bottom 1.27: K3.6 27.17,48.27 24.41,51.03 24.41,60.48 25.91,61.98 OK2.4
  Bottom 2.54: J13.A1 J13.A2 | K2.2 23.97,26.03 K2.4 23.97,29.59 K1.2 23.97,37.03 K1.4
  other vias: 23,35 24,35 23,24 24,24 14,16 13,16 36,7 35,8 34,9
  pour Top: 26,41 23,41 21,39 21,34 23,32 23,30 21,28 21,23 23,21 23,18 22,17 16,17 12,21 6,21 12,15 27,15 37,5 46,5 46,8 40,14 33,14 26,21
  pour Bottom: 26,41 23,41 21,39 21,34 23,32 23,30 21,28 21,23 23,21 23,18 22,17 16,17 13,20 12,21 7,21 7,20 12,15 27,15 37,5 46,5 46,8 40,14 33,14 26,21
BOOT1  (via drill 0.35)
  Top 0.254: v88.5,42 88.7,41.8 U1.P2$5 | v64.5,42 64.57,42.13 64.57,52.57 v68,56
  Bottom 0.254: J27.6 69.7,57.7 v68,56 | v88.5,42 v64.5,42
GND  (via drill 0.35)
  Top 0.254: U4.3 v88,12 | U4.1 87,11 v88,12 | U4.5 89,11 v88,12 | v88,12 88.5,12.5 U4.7 U4.6 | U5.P$2 87.75,17.75 v88,18 | Q12.1 87.35,59.35 v88,60 88.65,60.65 Q12.4 | v88,75 89.91,76.91 U2.1 | OK2.2 39.41,59.44 C9.2 | v73,6 v79,6 v80,6 v86,6
  Top 1.016: C9.2 C10.2
  Top 1.27: U1.P1$19 50.54,54.22 50.54,61.28 48.67,63.15 IC1.1 47.3,66.8 PSU1.-V
  Bottom 0.254: 90.12,72.88 v88,75 86.51,76.49 86.51,82.51 v88,84 | v93.5,82 v93.5,81 v93.5,71 v93.5,70 | v80.5,82 v80.5,81 v80.5,71 v80.5,70
  other vias: 90,69 87.3,82.8 39,41 39,33 39,30 39,22 52,31 39,52 37,90 55,72 59,72 49,63 56,58 58,54 97,71 92.5,65.7 91,62 94,62 97,61 89.5,56 90,50 95,53 96,50 99,50 91,42 73.9,57.3 75.6,60.9 76.9,62.2 74.3,59.6 76,57 77,56 81.9,67.3 86,67 69,56 78,43 75,43 79,39 81,39 84.3,39 86,39 76.9,39 74.5,39 71,43 68,43 72,39 68,39 66,39 61,43 61,39 77,23 82,21.2 83,29 82,17 77,17 93,18 67,34 84.8,15 94,21 95,30 38,44 84,23 84,20 88,27 93,15 88,57
  pour Top: 36,21 36,92 102,92 102,0 71,0 71,21
  pour Bottom: 36,21 36,92 102,92 102,0 71,0 71,21
HEATER_1
  Top 2.54: J14.A1 J14.A2 14.84,25 K2.3
  Bottom 2.54: K2.3 14.84,25 J14.A2 J14.A1
HEATER_2
  Top 2.54: J11.A1 J11.A2 12.84,38 K1.3
  Bottom 2.54: K1.3 12.84,38 J11.A2 J11.A1
I2C1_SCL  (via drill 0.35)
  Top 0.254: U5.P$5 88.75,20.75 v89,21 | R23.2 v76,11 74.48,9.48 J2.4 | U1.P1$14 65.84,41.54 67.14,40.24 67.14,35.03 70.25,31.91 76.85,31.91 79,29.76 v79,29
  Bottom 0.254: v89,21 89,20.75 85.5,17.25 85.5,10.57 83.85,8.92 78.08,8.92 v76,11 76,27.66 77.47,29.13 78.87,29.13 v79,29
I2C1_SDA  (via drill 0.35)
  Top 0.254: R24.2 v78,11 77.04,11 75.48,9.44 J2.3 | U1.P1$15 63.3,40.19 64.59,38.9 64.59,35.03 68.86,30.77 76.12,30.77 77.62,29.27 77.62,28.38 v78,28 | U5.P$4 88.75,17.12 89.28,17.65 89.28,20.32 89.66,20.7 89.66,21.27 89.27,21.66 88.16,21.66 v88,21.5
  Bottom 0.254: v88,21.5 84.04,17.54 84.04,13.87 84.17,13.75 84.17,10.6 83.4,9.83 80.47,9.83 79.31,11 v78,11 v78,28
I2C2_SCL  (via drill 0.35)
  Top 0.254: U1.P2$4 91.24,34.81 85.71,29.28 85.71,28.71 v83,26 | R25.2 81,11.08 | 81,11.08 v81,11 | J3.4 81.48,10.6 81,11.08
  Bottom 0.254: v83,26 81,24 v81,11
I2C2_SDA  (via drill 0.35)
  Top 0.254: U1.P1$11 73.46,43.44 79.83,37.06 79.83,28.66 v80.5,28 | R26.2 v83,11 82.48,10.48 J3.3
  Bottom 0.254: v83,11 83,24.21 84.27,25.48 84.27,26.49 83.37,27.4 81.1,27.4 v80.5,28
N$1
  Top 2.54: J20.A2 J20.A1 16.65,7
  Top 3.81: 16.65,7 F1.1
  Bottom 2.54: J20.A2 J20.A1 16.65,7
  Bottom 3.81: 16.65,7 F1.1
N$2
  Top 0.406: B1.- 59.5,10.85 R22.1 | R22.1 63.1,10.85 D5.C | Q10.1 61,12.05 R22.1
N$3
  Top 0.813: J4.1 91,85 FB2.1
N$4
  Top 0.813: J4.2 85,84.5 FB1.1
N$5
  Top 0.406: C3.1 88.64,79.78
  Top 0.508: 88.64,79.78 U2.2
  Top 0.813: FB2.2 88.97,79.65 88.85,79.77 C3.1
N$6  (via drill 0.35)
  Top 0.254: v92,22 92,23.35 R17.1 R19.1
  Bottom 0.254: J7.3 94,24 v92,22
N$7
  Top 0.406: Q10.3 57.52,14 OK1.2
N$8
  Top 0.61: R2.1 27.56,53.15 28.26,53.85 OK2.6
N$9
  Top 0.61: R2.2 26.47,54.85 24.31,57.01 TR1.3
N$10
  Top 0.61: D2.A 41.75,39 LED1.C 42,40.1 Q1.3
  Top 0.813: K1.1 35.08,39 D2.A
N$11
  Top 0.61: D3.A 41.75,28 LED2.C 42,29.1 Q2.3
  Top 0.813: K2.1 35.08,28 D3.A
N$12
  Top 0.254: LED3.C 42,51.1 Q3.3 41.71,50.81 K3.4
  Bottom 0.254: K3.1 37.5,44.88 37.5,46.58 K3.3 K3.4
N$13
  Top 0.254: Q4.2 Q1.1
N$14
  Top 0.254: Q5.2 Q2.1
N$15
  Top 0.254: Q6.2 Q3.1
N$16
  Top 0.254: Q6.1 47.95,45.9 R8.2
N$17
  Top 0.254: R5.1 46,46.9 Q6.3
N$18
  Top 0.254: R4.1 46,24.9 Q5.3
N$19
  Top 0.254: Q5.1 47.95,23.9 R7.2
N$20
  Top 0.254: R3.1 46,35.9 Q4.3
N$21
  Top 0.254: Q4.1 47.95,34.9 R6.2
N$22
  Top 0.254: U5.P$8 87.25,17.53 86.77,17.05 86.77,15.02 87,14.79 U4.10
N$23  (via drill 0.35)
  Top 0.254: R29.1 R18.1 92,25.65 v92,27
  Bottom 0.254: J7.2 93,26 v92,27
N$24
  Top 0.254: LED1.A 42.4,34.85 R9.1
N$25
  Top 0.254: R30.2 35.93,45.85 K3.2
N$26
  Top 0.406: C3.2 87.36,79.78
  Top 0.508: 87.36,79.78 U2.3
  Top 0.813: FB1.2 87.15,79.65 C3.2
N$27
  Top 1.27: C5.2 19.5,45.91 21.16,47.56 21.16,50.61 23.55,53 R13.1
N$28
  Top 0.254: LED2.A 42.4,23.85 R10.1
N$29
  Top 0.254: LED3.A 42.4,45.85 R11.1
N$30
  Top 0.61: Q8.3 73,27.1 D1.A 73,24.85 R12.1
  Top 0.813: SP1.1 70.81,25.05 D1.A
N$31
  Top 1.27: C16.2 23.8,46.7 R35.1
N$33
  Top 0.254: Q9.2 Q8.1
N$34
  Top 0.254: Q9.1 80,24.95 R28.2
N$35
  Top 0.254: Q9.3 R27.1
N$36
  Top 0.406: R21.2 51,12.42 C12.2 51.45,11.3 B1.~1
N$37
  Top 0.406: R20.2 51,7.58 C12.1 51.45,8.7 B1.~2
N$38
  Top 0.254: U4.9 87.5,14.92 87.25,15.17 U5.P$1
N$39
  Top 0.61: OK2.1 37,55.78 R1.2
N$41
  Top 0.254: Q11.D2 88.95,65.71 89.69,66.45 93.45,66.45 J9.3
N$42
  Top 0.254: Q11.D1 87.05,65.46 89.19,67.59 92.59,67.59 J9.2
N$43
  Top 0.406: C6.2 65.33,8.48 65.33,11.25 64,12.58 D5.A 63.1,14.95 Q10.2
N$44
  Top 0.406: R15.2 59.13,6.15 56.89,8.4 56.89,11.63 54.73,13.79 OK1.1
N$45
  Top 0.406: B1.+ 59.5,9.15 R22.2 R15.1 C6.1
N$46
  Top 0.254: Q12.2 88,58.54 87.79,58.32 86.9,58.32 86.64,58.58 86.64,59.2 R33.1
N$47
  Top 0.254: Q12.3 88.65,59.69 89.19,60.23 89.19,61.5 88.93,61.75 88.93,62.78 Q11.G2 90.65,62.8 R32.1
N$48
  Top 0.254: Q12.6 87.35,61.56 87.05,61.86 Q11.G1 85.35,62.8 R31.1
N$49  (via drill 0.35)
  Top 0.254: Q12.5 v88,61.8 | v90,61.8 90.95,60.85 R34.1
  Bottom 0.254: v88,61.8 v90,61.8
NRST  (via drill 0.35)
  Top 0.254: v66,56 62.05,52.05 62.05,37.67 U1.P2$16
  Bottom 0.254: J27.5 67.16,57.16 v66,56
PA0  (via drill 0.35)
  Top 0.254: U1.P2$15 60.92,34 v56,34 | v59,31 54,26 R14.1 53.85,24.63 OK1.4
  Bottom 0.254: v59,31 v56,34
PA1  (via drill 0.35)
  Top 0.254: R1.1 37.91,53.15 39.91,55.15 44.84,55.15 49.56,50.43 49.56,43.72 50.58,42.7 50.58,41.18 53.76,38 v59.5,38
  Bottom 0.254: U1.P2$14 64.22,38 v59.5,38
PA6  (via drill 0.35)
  Top 0.254: U2.6 87.36,72.96 86.86,73.47 85.66,73.47 85.14,72.95 85.14,69.14 v84,68 | v73.31,55.53 73.31,54.21 72.17,53.07 72.17,42.76 U1.P2$9
  Bottom 0.254: v84,68 81.66,68 73.18,59.52 73.18,55.66 v73.31,55.53
PA8
  Top 0.254: U1.P1$5 88.7,56.69 89.86,57.85 R36.2 R34.2
PA15
  Top 0.254: U1.P1$10 77.3,50.32 86.64,50.32 87.45,51.12 87.45,56.62 85,59.07 R33.2 R37.2
PB0
  Top 0.254: J8.2 93.63,59.63 93.63,53.7 92.48,52.56 92.48,50.71 83.62,41.84 U1.P2$7
  Bottom 0.254: R16.2 J8.2
PB8  (via drill 0.35)
  Top 0.254: v95,62 95,63 J8.1
  Bottom 0.254: U1.P1$16 62.54,53.4 90.1,53.4 96.21,59.51 96.21,60.79 v95,62
PB9  (via drill 0.35)
  Top 0.254: v95,60 96,59 J8.5
  Bottom 0.254: U1.P1$17 61.01,54.41 89.41,54.41 v95,60
PB12  (via drill 0.35)
  Top 0.254: U1.P1$1 90.03,42.79 90.03,35.03 v88,33 | v63,33 62.85,33.15 R6.1 R40.2
  Bottom 0.254: v63,33 63.69,32.31 87.31,32.31 v88,33
PB13  (via drill 0.35)
  Top 0.254: U1.P1$2 87.51,42.81 87.51,33.51 v87,33 | v64,33 63.28,32.29 50.98,32.29 49.52,30.84 49.52,26.32 50,25.84 R39.2 49.95,23.85 48.25,22.15 R7.1
  Bottom 0.254: v87,33 v64,33
PB14
  Top 0.254: U1.P1$3 93.78,50.48 85.02,41.71 85.02,35.45 81.78,32.22 81.78,21.93 R28.1 R41.2
PB15
  Top 0.254: J5.2 100.13,79.87 100.13,71.43 92.72,64.02 92.72,54.11 91.24,52.64 U1.P1$4
PC13
  Top 0.254: R8.1 R38.2 48.25,42.85 49.21,41.89 49.21,40.31 U1.P2$19
PC14  (via drill 0.35)
  Top 0.254: v91,22 90.65,22 R19.2 C14.1
  Bottom 0.254: U1.P2$18 61.93,30.13 86.01,30.13 91,25.14 v91,22
PC15  (via drill 0.35)
  Top 0.254: v91,27 90.65,27 R29.2 C4.1
  Bottom 0.254: U1.P2$17 58.22,36 62.82,31.4 86.6,31.4 v91,27
PRESSURE
  Top 0.254: J6.3 88.5,6.5 U4.4
PUMP_P
  Top 1.27: TR1.1 17.79,56 16.77,56 | 16.77,56 J17.A2 J17.A1 | R13.2 18.2,54.57 16.77,56
  Bottom 1.27: J17.A2 J17.A1
SPI1_MISO  (via drill 0.35)
  Top 0.254: v91.2,69 88.64,71.56 U2.7 | U1.P1$12 70.92,54.14 73.4,56.62 75.38,56.62 v76,56
  Bottom 0.254: v76,56 77.52,57.52 77.52,59.06 83.05,64.62 86.82,64.62 v91.2,69
SPI1_SCK  (via drill 0.35)
  Top 0.254: v89,69 86.09,71.91 U2.5 | U1.P2$10 69.62,42.76 69.62,54.19 73.44,58 v76,58
  Bottom 0.254: v89,69 89,68.49 86.21,65.7 82.68,65.7 76,59.02 v76,58
SWCLK  (via drill 0.35)
  Top 0.254: v60.4,55.9 59.51,55.01 59.51,47.83 J26.3
  Bottom 0.254: J25.3 60.81,79.73 60.81,56.31 v60.4,55.9
SWDIO  (via drill 0.35)
  Top 0.254: J26.2 57.04,47.9 57.04,55.04 v57.9,55.9
  Bottom 0.254: J25.2 58.32,79.78 58.32,56.32 v57.9,55.9
UART1_RX
  Top 0.254: U1.P1$7 73.36,61.88 63.66,61.88 J27.2
UART1_TX
  Top 0.254: U1.P1$6 74.12,63.66 64.42,63.66 J27.3
UART2_RX  (via drill 0.35)
  Top 0.254: v86,34 85,33 v85,29
  Bottom 0.254: U1.P2$12 70.92,35.4 71.28,35.03 85.35,35.03 86,34.38 v86,34 | J1.2 91.14,16 90.53,16.61 90.53,21.44 85.58,26.39 85.58,27.16 85,27.73 v85,29
UART2_TX  (via drill 0.35)
  Top 0.254: v85,34 84,33 v84,29
  Bottom 0.254: U1.P2$13 68.38,35.36 69.6,34.14 84.86,34.14 v85,34 | J1.3 91.89,13.5 89.94,15.45 89.94,21.29 84.89,26.34 84.89,26.97 84,27.86 v84,29

### Text on the board
Top: iuiuiu v2.1
tPlace: + - | 3V3 / SWDIO / SWCLK / GND | G / R1 / R2 | 3V3 / RX / TX / GND / NRST / BOOT1 | D1 / CLK / GND / 5V / D2 | N / P / 3WV | N / H2 | G / S / B | N / H1 / L | DANGER! HIGH VOLTAGE! | G TX RX 5V | 5V / G / P | N L
bPlace: DANGER! HIGH VOLTAGE!